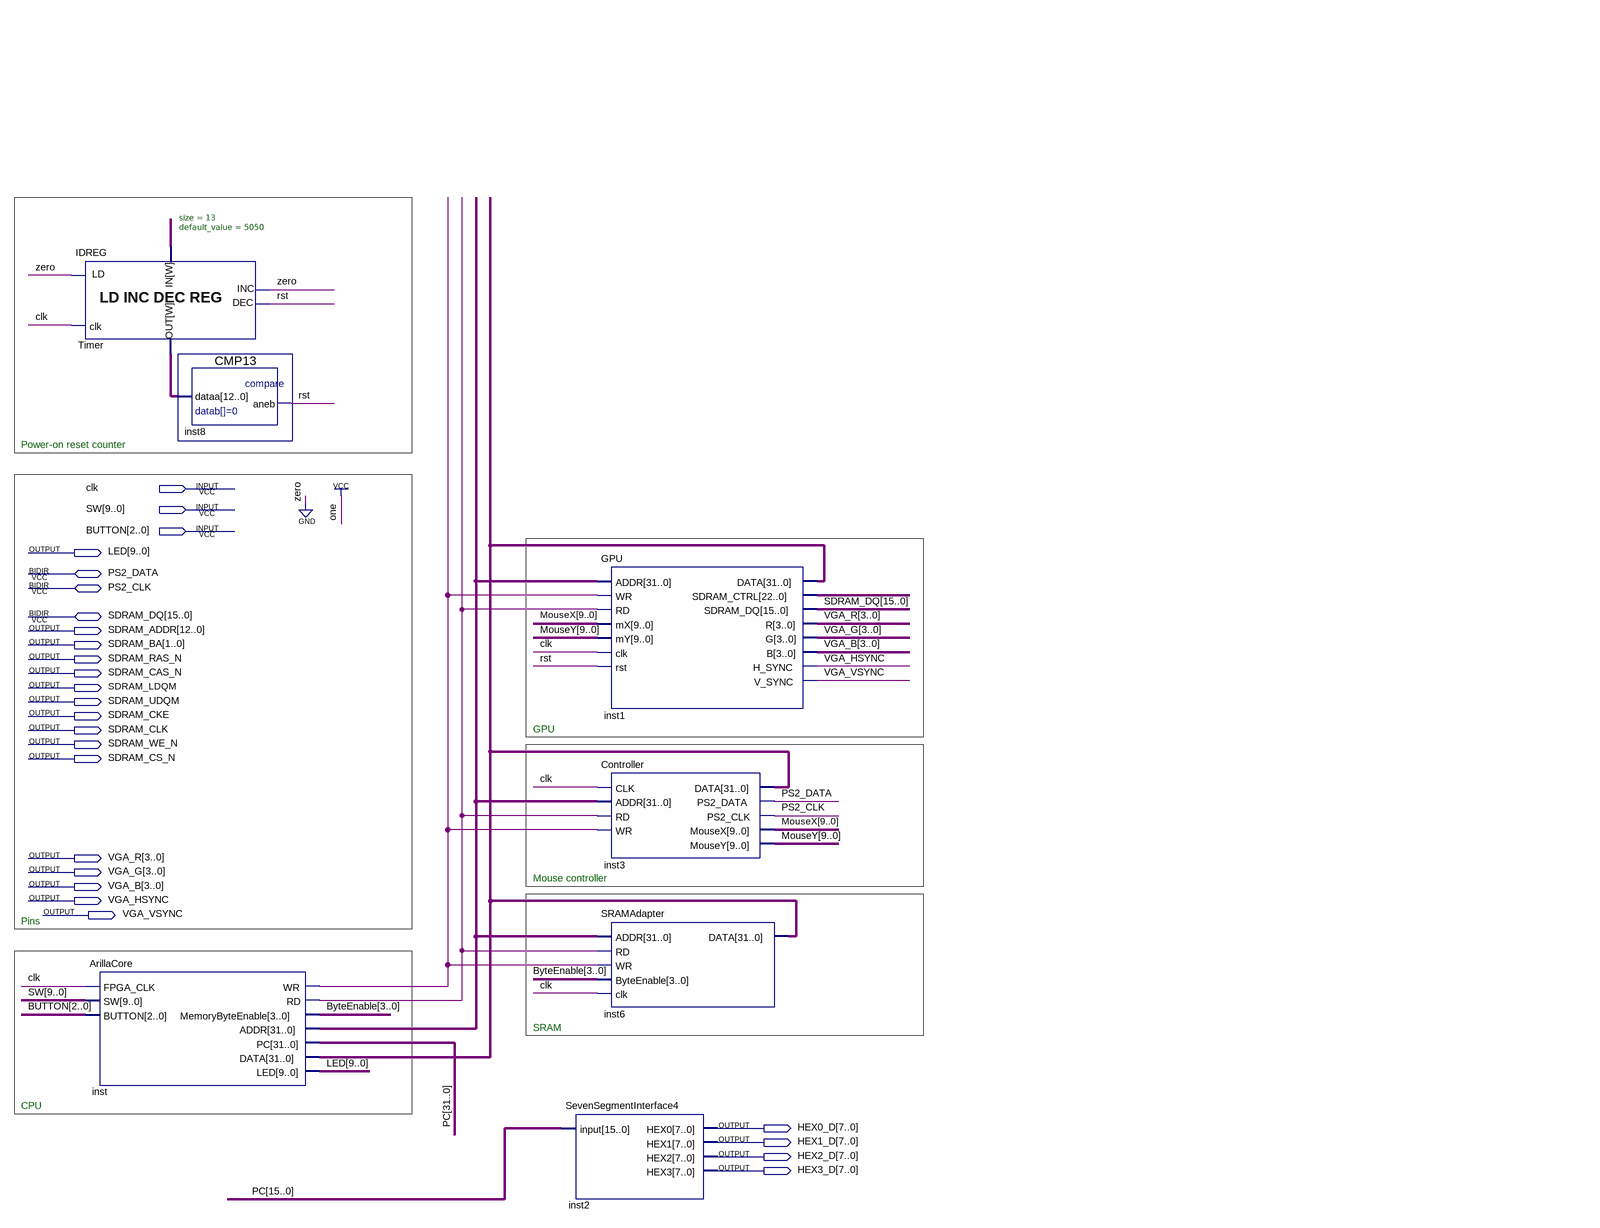
[diagram p0: schematic sheet]
// Quartus schematic ArillaTopLevel.bdf as structural Verilog: 7 symbols, 26 pins
module ArillaTopLevel (
  input  clk,
  input  [9:0] SW,
  input  [2:0] BUTTON,
  inout  PS2_DATA,
  inout  PS2_CLK,
  inout  [15:0] SDRAM_DQ,
  output [9:0] LED,
  output [12:0] SDRAM_ADDR,
  output [1:0] SDRAM_BA,
  output SDRAM_RAS_N,
  output SDRAM_CAS_N,
  output SDRAM_LDQM,
  output SDRAM_UDQM,
  output SDRAM_CKE,
  output SDRAM_CLK,
  output SDRAM_WE_N,
  output SDRAM_CS_N,
  output [3:0] VGA_R,
  output [3:0] VGA_G,
  output [3:0] VGA_B,
  output VGA_HSYNC,
  output VGA_VSYNC,
  output [7:0] HEX0_D,
  output [7:0] HEX1_D,
  output [7:0] HEX2_D,
  output [7:0] HEX3_D
);

  wire inst_rd, inst_wr, rst;
  wire [3:0] ByteEnable;
  wire [9:0] MouseX, MouseY;
  wire [12:0] Timer_data_out;
  wire [31:0] inst_addr, inst_data, PC;

  IDREG #(.size(13), .default_value(5050)) Timer (
    .clk(clk), .data_in({13{1'b0}}), .inc(1'b0), .dec(rst), .ld(1'b0), .data_out(Timer_data_out));
  ArillaCore inst (
    .FPGA_CLK(clk), .SW(SW), .BUTTON(BUTTON), .WR(inst_wr), .RD(inst_rd), .MemoryByteEnable(ByteEnable),
    .ADDR(inst_addr), .PC(PC), .LED(LED), .DATA(inst_data));
  CMP13 inst8 (.dataa(Timer_data_out), .aneb(rst));
  SevenSegmentInterface4 inst2 (.\input (PC[15:0]), .HEX0(HEX0_D), .HEX1(HEX1_D), .HEX2(HEX2_D), .HEX3(HEX3_D));
  GPU inst1 (
    .ADDR(inst_addr), .WR(inst_wr), .RD(inst_rd), .mX(MouseX), .mY(MouseY), .clk(clk), .rst(rst),
    .SDRAM_CTRL({SDRAM_ADDR, SDRAM_BA, SDRAM_RAS_N, SDRAM_CAS_N, SDRAM_LDQM, SDRAM_UDQM, SDRAM_CKE, SDRAM_CLK, SDRAM_WE_N, SDRAM_CS_N}),
    .R(VGA_R), .G(VGA_G), .B(VGA_B), .H_SYNC(VGA_HSYNC), .V_SYNC(VGA_VSYNC), .DATA(inst_data),
    .SDRAM_DQ(SDRAM_DQ));
  Controller inst3 (
    .CLK(clk), .ADDR(inst_addr), .RD(inst_rd), .WR(inst_wr), .MouseX(MouseX), .MouseY(MouseY),
    .DATA(inst_data), .PS2_DATA(PS2_DATA), .PS2_CLK(PS2_CLK));
  SRAMAdapter inst6 (
    .ADDR(inst_addr), .RD(inst_rd), .WR(inst_wr), .ByteEnable(ByteEnable), .clk(clk), .DATA(inst_data));

  // Notes on the sheet:
  //   Power-on reset counter
  //   GPU
  //   Mouse controller
  //   Pins
  //   SRAM
  //   CPU
endmodule
